# EAGLE design recepteurRF (EAGLE 6.6.0)
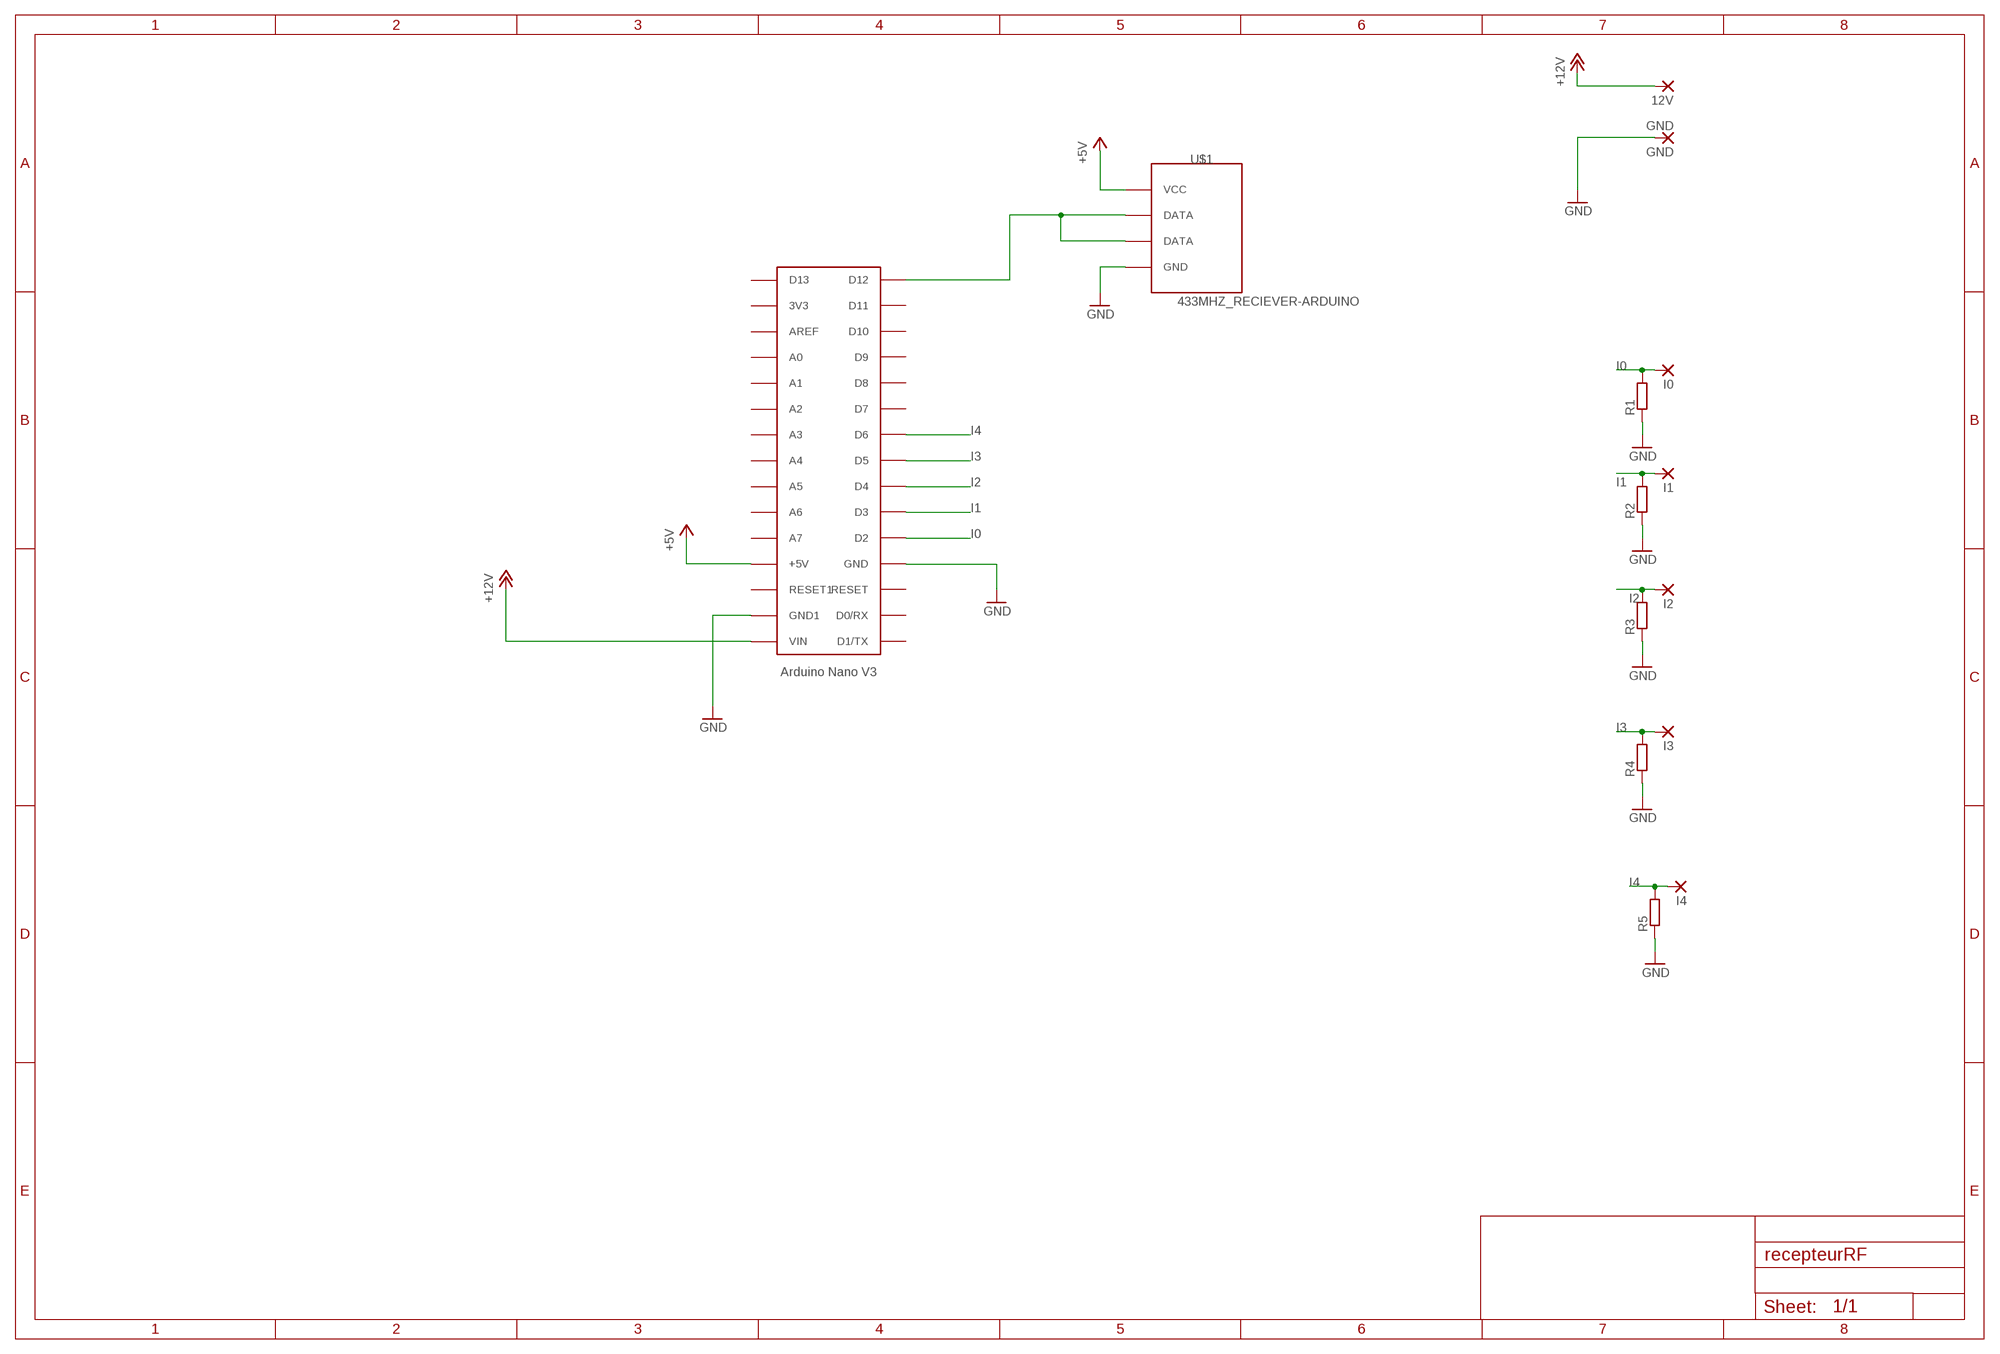
[diagram p0: schematic, sheet 1]

## Parts
12V  SMD5  [SMD2,54-5,08]
GND  GND  SMD5  [SMD2,54-5,08]
I0  SMD5  [SMD2,54-5,08]
I1  SMD5  [SMD2,54-5,08]
I2  SMD5  [SMD2,54-5,08]
I3  SMD5  [SMD2,54-5,08]
I4  SMD5  [SMD2,54-5,08]
R1  R-EU_R1206  [R1206]
R2  R-EU_R1206  [R1206]
R3  R-EU_R1206  [R1206]
R4  R-EU_R1206  [R1206]
R5  R-EU_R1206  [R1206]
U$1  433MHZ_RECIEVER-ARDUINO  [433MHZ_RECIEVER-ARDUINO]
U$2  ARDUINONANO  [PDIP-32]

## Nets
+5V: U$1.VCC U$2.+5V
+12V: 12V.1(P) U$2.VIN
GND: GND.1(P) R1.1 R2.1 R3.1 R4.1 R5.1 U$1.GND U$2.GND U$2.GND1
I0: I0.1(P) R1.2 U$2.D2
I1: I1.1(P) R2.2 U$2.D3
I2: I2.1(P) R3.2 U$2.D4
I3: I3.1(P) R4.2 U$2.D5
I4: I4.1(P) R5.2 U$2.D6
N$1: U$1.DATA@0(DATA) U$1.DATA@1(DATA) U$2.D12
Unconnected: U$2.3V3 U$2.A0(A7) U$2.A1(A6) U$2.A2(A5) U$2.A3(A4) U$2.A4(A3) U$2.A5(A2) U$2.A6(A1) U$2.A7(A0) U$2.AREF U$2.D0/RX U$2.D1/TX U$2.D7 U$2.D8 U$2.D9 U$2.D10 U$2.D11 U$2.D13 U$2.RESET U$2.RESET1

## Library data of the parts
12V GND I0 I1-I4 = wirepad:SMD5: SMD PAD
R1-R5 = rcl:R-EU_: RESISTOR, European symbol
U$1 = BaseApp:433MHZ_RECIEVER-ARDUINO
U$2 = CRE-Lib1:ARDUINONANO: Arduino Nano

## Board
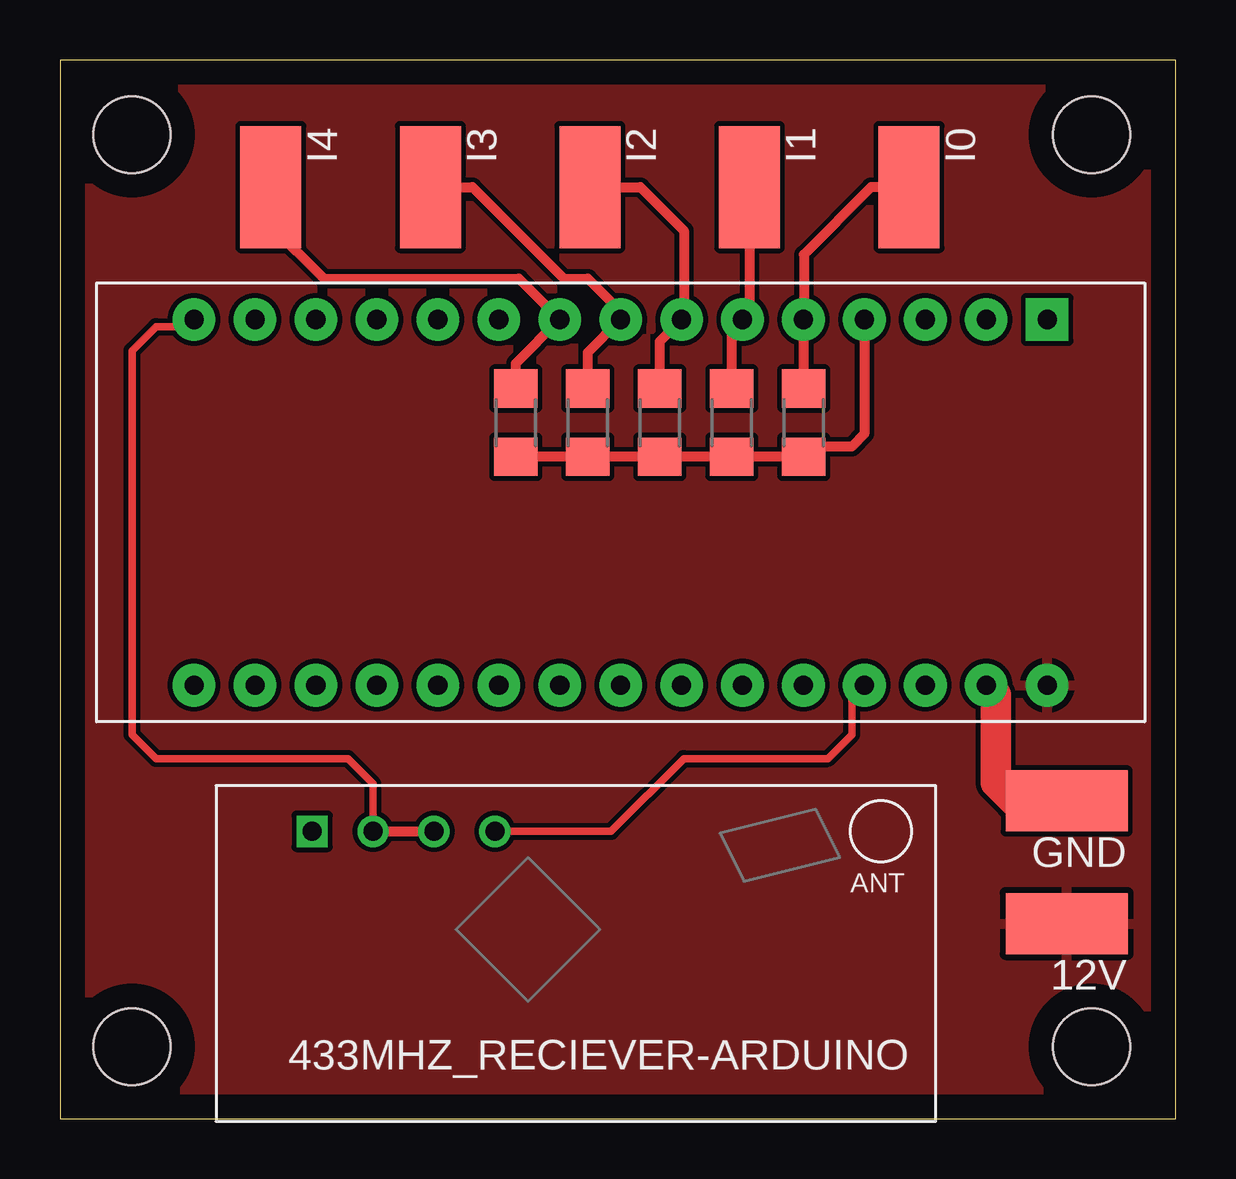
[diagram p1: board, top side]
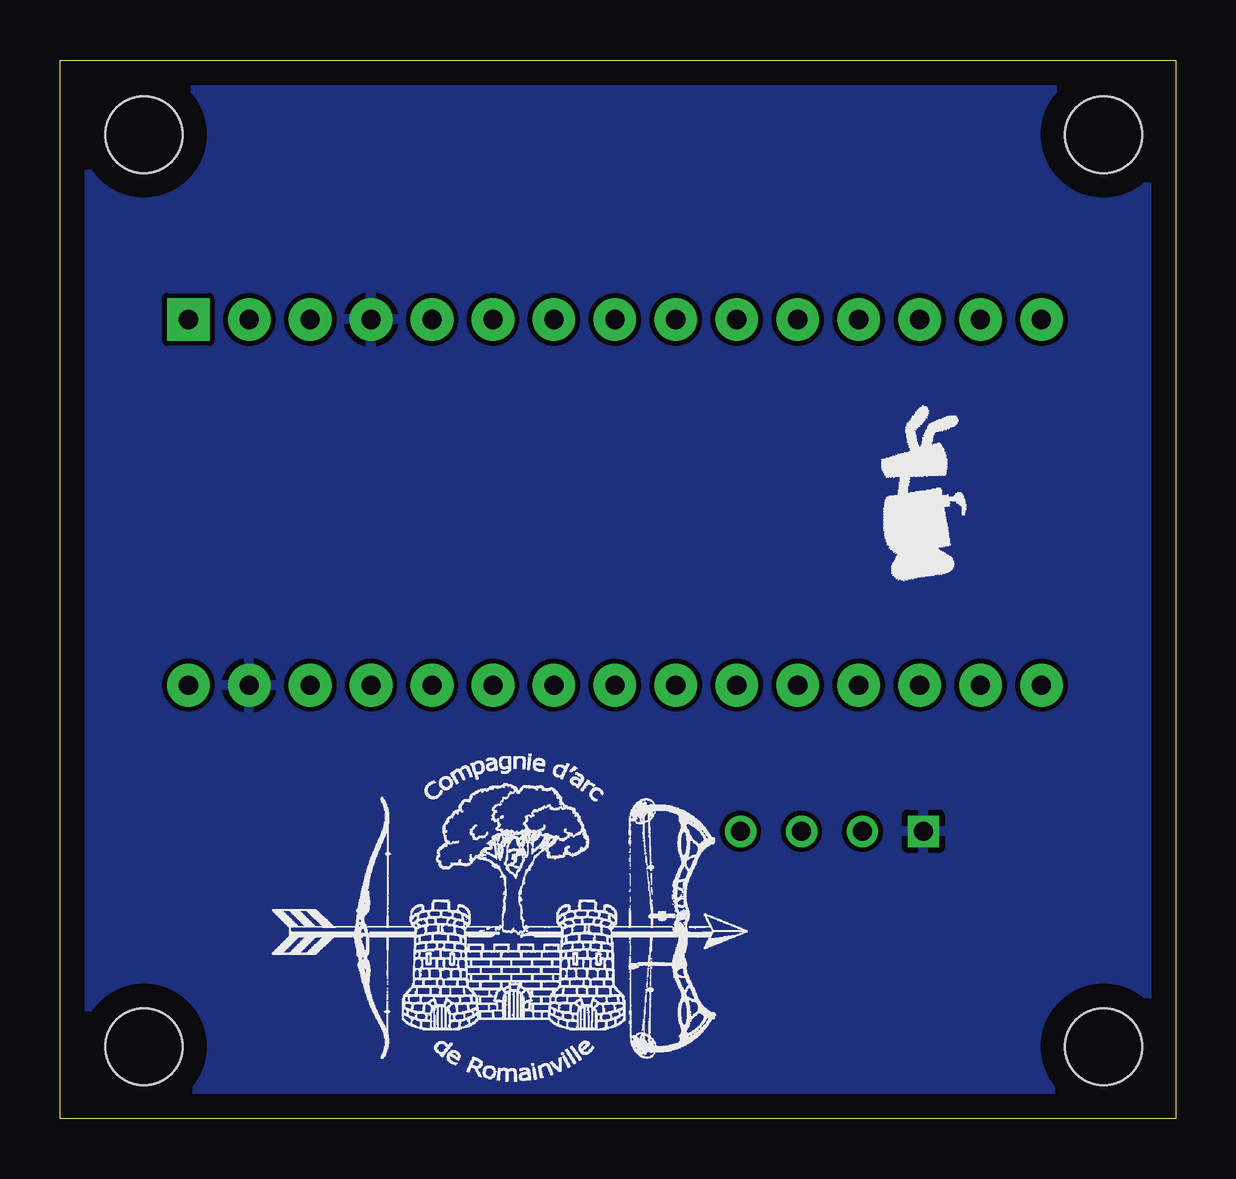
[diagram p2: board, bottom side, seen from below]

Size 46.5 x 44.11 mm. Coordinates in mm from the lower left corner, seen from the top.
Outline: 0,0 46.5,0 46.5,44.11 0,44.11 0,0
Copper layers (1*16): Top 0.035mm / dielectric 1.5mm / Bottom 0.035mm
Design rules "dirt_cheap_dirty_boards.v1": minimum track width 10mil, minimum drill 0.6mm, track to track 8mil, track to pad 8mil, pad to pad 8mil, via to via 8mil, smd to smd 8mil, copper to edge 40mil, drill to drill 8mil, minimum pad ring 10mil, minimum via ring 8mil, stop-mask expansion 4mil, vias tented up to drill 0mil, thermal gap 10mil
Holes 3.2 mm at 3,41 43,41 43,3 3,3

### Footprints (pad centres in the part's own frame; a part is rotated, then mirrored left to right if it is on the bottom)
SMD2,54-5,08 = smd 2.54 x 5.08: 1 0,0
R1206 = smd 1.6 x 1.803: 1 -1.422,0; 2 1.422,0
433MHZ_RECIEVER-ARDUINO = drill 0.8: DATA@0 -8.46,5.08; DATA@1 -5.92,5.08; VCC -3.38,5.08 | drill 0.8 square: GND -11,5.08
PDIP-32 = drill 0.8 pad 1.778: 3V3 15.24,-35.56; +5V 15.24,-10.16; A0 15.24,-12.7; A1 15.24,-15.24; A2 15.24,-17.78; A3 15.24,-20.32; A4 15.24,-22.86; A5 15.24,-25.4; A6 15.24,-27.94; A7 15.24,-30.48; AREF 15.24,-33.02; D0/RX 0,-5.08; D2 0,-12.7; D3 0,-15.24; D4 0,-17.78; D5 0,-20.32; D6 0,-22.86; D7 0,-25.4; D8 0,-27.94; D9 0,-30.48; D10 0,-33.02; D11 0,-35.56; D12 0,-38.1; D13 15.24,-38.1; GND 0,-10.16; GND1 15.24,-5.08; RESET 0,-7.62; RESET1 15.24,-7.62; VIN 15.24,-2.54 | drill 0.8 pad 1.778 square: D1/TX 0,-2.54

### Placement (x,y rotation side)
12V  41.96,8.13 90 top
GND  41.96,13.24 90 top
I0  35.39,38.81 180 top
I1  28.74,38.81 180 top
I2  22.09,38.81 180 top
I3  15.44,38.81 180 top
I4  8.79,38.81 180 top
R1  31,29 90 top
R2  28,29 90 top
R3  25,29 90 top
R4  22,29 90 top
R5  19,29 90 top
U$1  21.51,6.89 0 top
U$2  43.69,33.3 270 top
U$3  [LOGO]  38,1 0 bottom
U$4  [LOGO_GROS]  13,22 0 bottom

### Tracks (layer width: path | path; a pad name or v marks a point on that pad's centre or on a via)
+5V
  Top 0.305: U$1.VCC 22.97,11.97 26,15 32,15 33,16 33,17.53 U$2.+5V
+12V
  pour Top: -1,46 48,46 48,-2 -1,-2
GND
  Top 0.406: U$2.GND 33.53,28.53 33,28 31.42,28 R1.1 R2.1 R3.1 R4.1 R5.1
  Top 1.27: GND.1 39.76,13.24 39,14 39,17.67 U$2.GND1
  pour Bottom: 0,45 47,45 47,-1 0,-1
I0
  Top 0.406: I0.1 33.81,38.81 31,36 U$2.D2 R1.2
I1
  Top 0.406: I1.1 28.74,33.59 U$2.D3 28,32.85 R2.2
I2
  Top 0.406: I2.1 24.19,38.81 26,37 26,33.39 U$2.D4 25,32.39 R3.2
I3
  Top 0.406: I3.1 17.19,38.81 21,35 22,35 23,34 23,33.67 U$2.D5 22,31.93 R4.2
I4
  Top 0.406: I4.1 8.79,37.21 11,35 19.13,35 U$2.D6 19,31.47 R5.2
N$1
  Top 0.305: U$1.DATA@0 13.05,13.95 12,15 4,15 3,16 3,32 4,33 5.29,33 U$2.D12
  Top 0.406: U$1.DATA@0 U$1.DATA@1